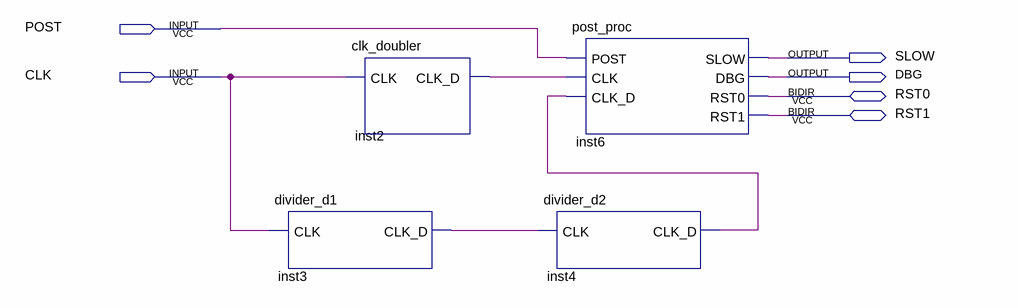
[diagram p0: schematic sheet]
// Quartus schematic main.bdf as structural Verilog: 4 symbols, 6 pins
module main (
  input  POST,
  input  CLK,
  inout  RST0,
  inout  RST1,
  output SLOW,
  output DBG
);

  wire inst2_clk_d, inst3_clk_d, inst4_clk_d;

  divider_d1 inst3 (.CLK(CLK), .CLK_D(inst3_clk_d));
  clk_doubler inst2 (.CLK(CLK), .CLK_D(inst2_clk_d));
  post_proc inst6 (
    .POST(POST), .CLK(inst2_clk_d), .CLK_D(inst4_clk_d), .SLOW(SLOW), .DBG(DBG), .RST0(RST0), .RST1(RST1));
  divider_d2 inst4 (.CLK(inst3_clk_d), .CLK_D(inst4_clk_d));
endmodule
